# EAGLE design schematic (EAGLE 8.3.1)
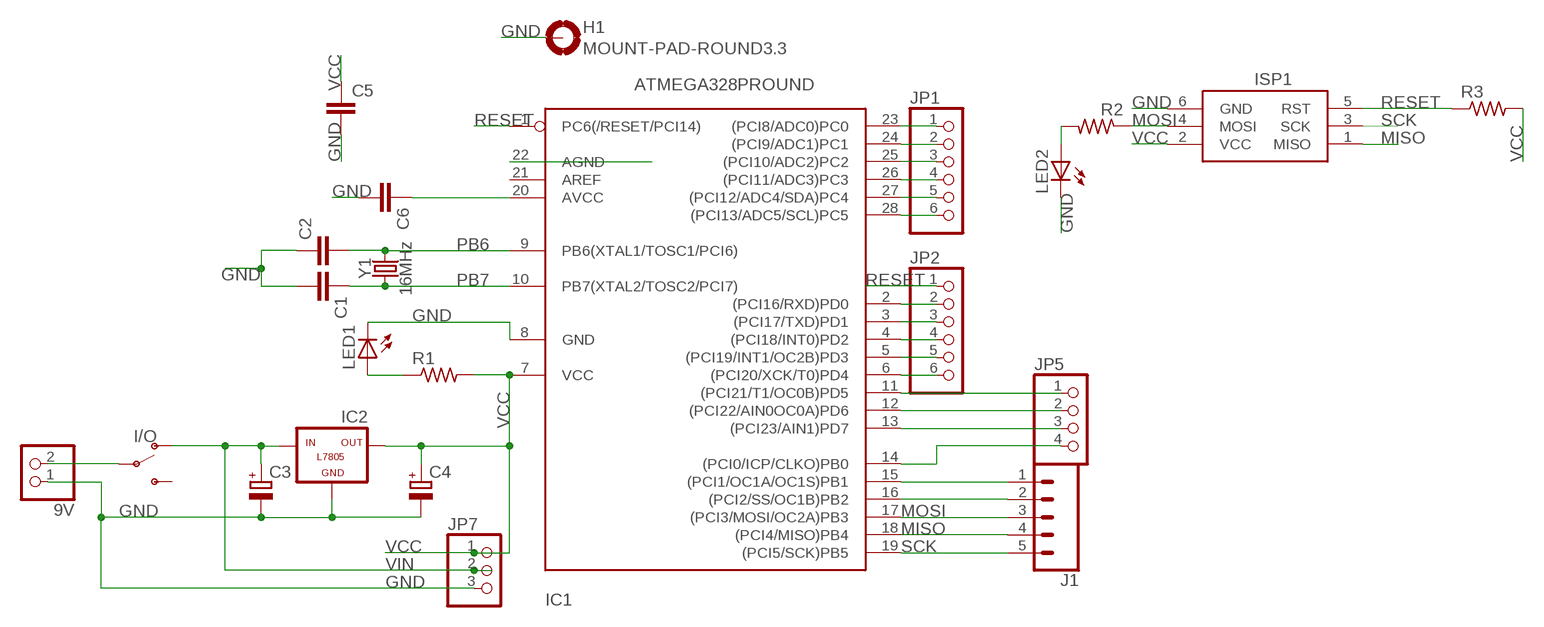
[diagram p0: schematic, sheet 1]

## Parts
9V  PINHD-1X2M  [1X02M]
C1  C5/5  [C5B5]
C2  C5/5  [C5B5]
C3  CPOL-EUB45181A  [B45181A]
C4  CPOL-EUB45181A  [B45181A]
C5  C-EU025-025X050  [C025-025X050]
C6  C-EU025-025X050  [C025-025X050]
H1  MOUNT-PAD-ROUND3.3  [3,3-PAD]
I/O  SWITCH-SPDT-PTH-11.6X4.0MM  [SWITCH_SPDT_PTH_11.6X4.0MM]
IC1  ATMEGA328PROUND  [DIL28-3-ROUND]
IC2  L7805  [78XXL]
ISP1  AVRISP-6  [AVRISP]
J1  CONN_05  [1X05]
JP1  PINHD-1X6  [1X06]
JP2  PINHD-1X6  [1X06]
JP5  PINHD-1X4  [1X04]
JP7  PINHD-1X3  [1X03]
LED1  LED3MM  [LED3MM]
LED2  LED3MM  [LED3MM]
R1  R-US_0207/10  [0207/10]
R2  R-US_0207/10  [0207/10]
R3  R-US_0207/10  [0207/10]
Y1  16MHz  CRYSTAL-16MHZPTH-HC49US  [HC49US]

## Nets
GND: 9V.1 C1.2 C2.1 C3.- C4.- C5.2 C6.2 H1.B3,3(MOUNT) IC1.8(GND) IC1.22(AGND) IC2.GND ISP1.6(GND) JP7.3 LED1.K(C) LED2.K(C)
MISO: IC1.18((PCI4/MISO)PB4) ISP1.1(MISO) J1.4
MOSI: IC1.17((PCI3/MOSI/OC2A)PB3) ISP1.4(MOSI) J1.3 R2.1
N$2: 9V.2 I/O.2(P)
N$3: LED1.A R1.1
N$4: IC1.28((PCI13/ADC5/SCL)PC5) JP1.6
N$5: IC1.27((PCI12/ADC4/SDA)PC4) JP1.5
N$6: IC1.16((PCI2/SS/OC1B)PB2) J1.2
N$7: IC1.15((PCI1/OC1A/OC1S)PB1) J1.1
N$8: IC1.14((PCI0/ICP/CLKO)PB0) JP5.4
N$9: LED2.A R2.2
N$10: IC1.26((PCI11/ADC3)PC3) JP1.4
N$11: IC1.25((PCI10/ADC2)PC2) JP1.3
N$12: IC1.24((PCI9/ADC1)PC1) JP1.2
N$13: IC1.23((PCI8/ADC0)PC0) JP1.1
N$14: IC1.6((PCI20/XCK/T0)PD4) JP2.6
N$15: IC1.5((PCI19/INT1/OC2B)PD3) JP2.5
N$16: IC1.4((PCI18/INT0)PD2) JP2.4
N$17: IC1.3((PCI17/TXD)PD1) JP2.3
N$18: IC1.2((PCI16/RXD)PD0) JP2.2
N$19: IC1.11((PCI21/T1/OC0B)PD5) JP5.1
N$20: IC1.12((PCI22/AIN0OC0A)PD6) JP5.2
N$21: IC1.13((PCI23/AIN1)PD7) JP5.3
N$22: C6.1 IC1.20(AVCC)
PB6: C2.2 IC1.9(PB6(XTAL1/TOSC1/PCI6)) Y1.2
PB7: C1.1 IC1.10(PB7(XTAL2/TOSC2/PCI7)) Y1.1
RESET: IC1.1(PC6(/RESET/PCI14)) ISP1.5(RST) JP2.1 R3.1
SCK: IC1.19((PCI5/SCK)PB5) ISP1.3(SCK) J1.5
VCC: C4.+ C5.1 IC1.7(VCC) IC2.OUT ISP1.2(VCC) JP7.1 R1.2 R3.2
VIN: C3.+ I/O.1(O) IC2.IN JP7.2
Unconnected: I/O.3(S) IC1.21(AREF)

## Library data of the parts
9V = pinhead:PINHD-1X2: PIN HEADER
C1 C2 = capacitor-wima:C: CAPACITOR naming: grid - package width
C3 C4 = rcl:CPOL-EU: POLARIZED CAPACITOR, European symbol
C5 C6 = resistor:C-EU: CAPACITOR, European symbol
H1 = holes:MOUNT-PAD-ROUND: MOUNTING PAD, round
I/O = SparkFun-Switches:SWITCH-SPDT: Single Pole, Double Throw (SPDT) Switch Single-pole, double-throw (SPDT) switch. Variant Overview SMD-AYZ0202 Surface Mount DPDT Switch <https://www.sparkfun.com/products/597> (COM-00597) Used on e.g. LilyPad Arduino USB - ATmega32U4 Board <https://www.sparkfun.com/products/12049> PTH-11.6X4.0MM SPDT Mini Power Switch <https://www.sparkfun.com/products/102> (COM-00102) Used on e.g. SparkFun Simon Says - Through-Hole Soldering Kit <https://www.sparkfun.com/products/10547> (KIT-10547) PTH-11.6X4.0MM-KIT KIT version of SPDT Mini Power Switch - Simplifies soldering by removing tStop of switch pins - only one side can be soldered. PTH-11.6X4.0MM-LOCK LOCK version of SPDT Mini Power Switch - Offset pins hold switch in place for easier soldering. SMD-RIGHT-ANGLE Surface Mount Right Angle Switch <https://www.sparkfun.com/products/10860> (COM-10860) Used on e.g. SparkFun ESP8266 Thing <https://www.sparkfun.com/products/13231>; PROD_ID: SWCH-08261; SF_SKU: COM-00102
IC1 = atmega328:ATMEGA328*P: MICROCONTROLLER 32 kBytes FLASH 2 kBytes SRAM 1 kBytes EEPROM USART 8-channel 10 bit ADC
IC2 = tango:L7805: VOLTAGE REGULATOR
ISP1 = adafruit:AVRISP: AVR ISP HEADER Standard 6 pin header for AVR programming
J1 = SparkFun-Connectors:CONN_05: Multi connection point. Often used as Generic Header-pin footprint for 0.1 inch spaced/style header connections On any of the 0.1 inch spaced packages, you can populate with these: Break Away Headers - Straight <https://www.sparkfun.com/products/116> (PRT-00116) Break Away Male Headers - Right Angle <https://www.sparkfun.com/products/553> (PRT-00553) Female Headers <https://www.sparkfun.com/products/115> (PRT-00115) Break Away Headers - Machine Pin <https://www.sparkfun.com/products/117> (PRT-00117) Break Away Female Headers - Swiss Machine Pin <https://www.sparkfun.com/products/743> (PRT-00743) For SCREWTERMINALS and SPRING TERMINALS visit here: Screw Terimnals on SparkFun.com <https://www.sparkfun.com/search/results?term=Screw+Terminals> (5mm/3.5mm/2.54mm spacing) This device is also useful as a general connection point to wire up your design to another part of your project. Our various solder wires solder well into these plated through hole pads. Hook-Up Wire - Assortment (Stranded, 22 AWG) <https://www.sparkfun.com/products/11375> (PRT-11375) Hook-Up Wire - Assortment (Solid Core, 22 AWG) <https://www.sparkfun.com/products/11367> (PRT-11367) View the entire wire category on our website here <https://www.sparkfun.com/categories/141> Special notes: Molex polarized connector foot print use with SKU : PRT-08231 with associated crimp pins and housings. 1MM SMD Version SKU: PRT-10208
JP1 JP2 = adafruit:PINHD-1X6: PIN HEADER
JP5 = pinhead:PINHD-1X4: PIN HEADER
JP7 = pinhead:PINHD-1X3: PIN HEADER
LED1 LED2 = adafruit:LED: LED OSRAM: - CHIPLED LG R971, LG N971, LY N971, LG Q971, LY Q971, LO R971, LY R971 LH N974, LH R974 LS Q976, LO Q976, LY Q976 LO Q996 - Hyper CHIPLED LW Q18S LB Q993, LB Q99A, LB R99A - SideLED LS A670, LO A670, LY A670, LG A670, LP A670 LB A673, LV A673, LT A673, LW A673 LH A674 LY A675 LS A676, LA A676, LO A676, LY A676, LW A676 LS A679, LY A679, LG A679 - Hyper Micro SIDELED® LS Y876, LA Y876, LO Y876, LY Y876 LT Y87S - SmartLED LW L88C, LW L88S LB L89C, LB L89S, LG L890 LS L89K, LO L89K, LY L89K LS L896, LA L896, LO L896, LY L896 - TOPLED LS T670, LO T670, LY T670, LG T670, LP T670 LSG T670, LSP T670, LSY T670, LOP T670, LYG T670 LG T671, LOG T671, LSG T671 LB T673, LV T673, LT T673, LW T673 LH T674 LS T676, LA T676, LO T676, LY T676, LB T676, LH T676, LSB T676, LW T676 LB T67C, LV T67C, LT T67C, LS T67K, LO T67K, LY T67K, LW E67C LS E67B, LA E67B, LO E67B, LY E67B, LB E67C, LV E67C, LT E67C LW T67C LS T679, LY T679, LG T679 LS T770, LO T770, LY T770, LG T770, LP T770 LB T773, LV T773, LT T773, LW T773 LH T774 LS E675, LA E675, LY E675, LS T675 LS T776, LA T776, LO T776, LY T776, LB T776 LHGB T686 LT T68C, LB T68C - Hyper Mini TOPLED® LB M676 - Mini TOPLED Santana® LG M470 LS M47K, LO M47K, LY M47K Source: http://www.osram.convergy.de/
R1-R3 = resistor:R-US_: RESISTOR, American symbol
Y1 = SparkFun-Clocks:CRYSTAL-16MHZ: 16MHz Crystal Digikey Example <http://www.digikey.com/product-search/en?keywords=535-9122-1-ND> Frequency: 16MHz Frequency Stability: ±50ppm Frequency Tolerance: ±20ppm Load Capacitance: 18pF SparkFun Products: Pro Micro -5V/16MHz <https://www.sparkfun.com/products/12640> SparkFun Serial Enabled LCD Kit <https://www.sparkfun.com/products/10097>; PROD_ID: XTAL-08181; SF_ID: COM-00536

## Board
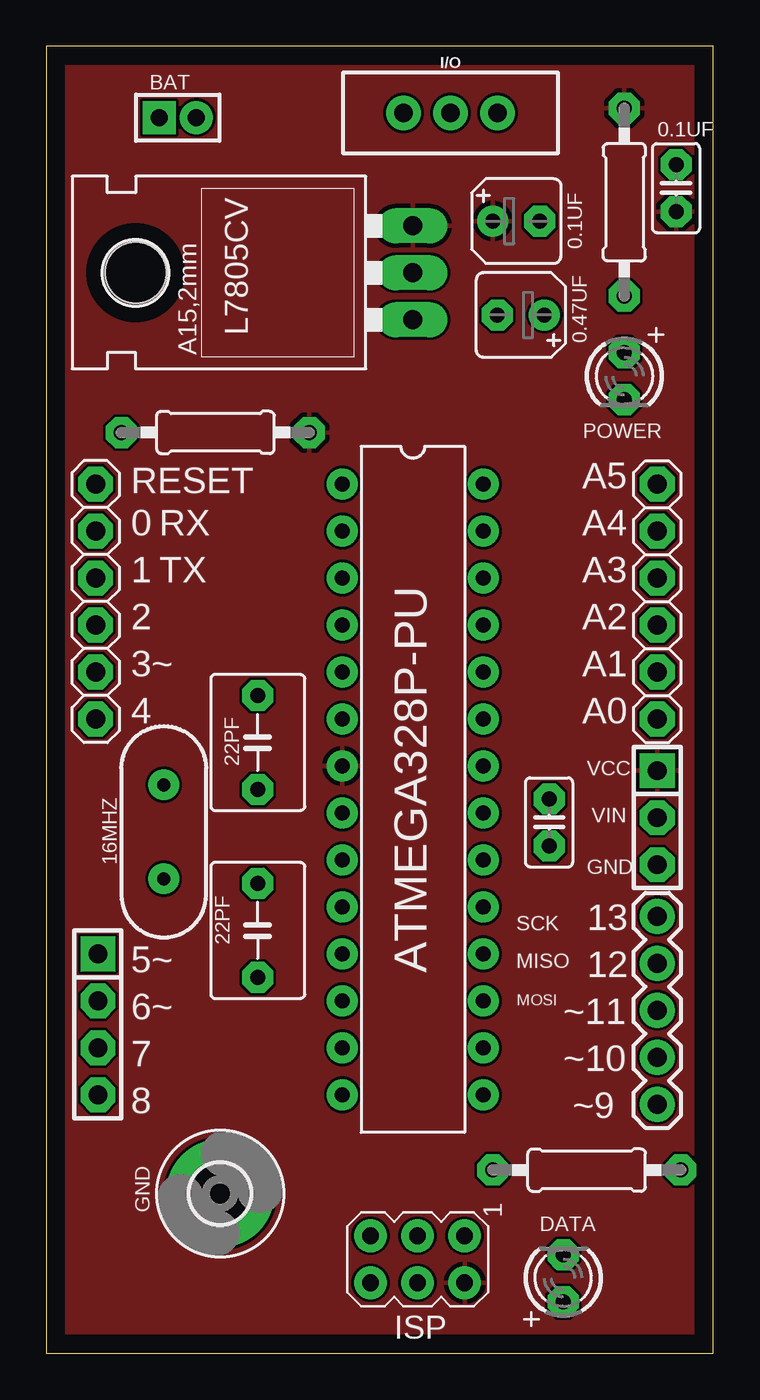
[diagram p1: board, top side]
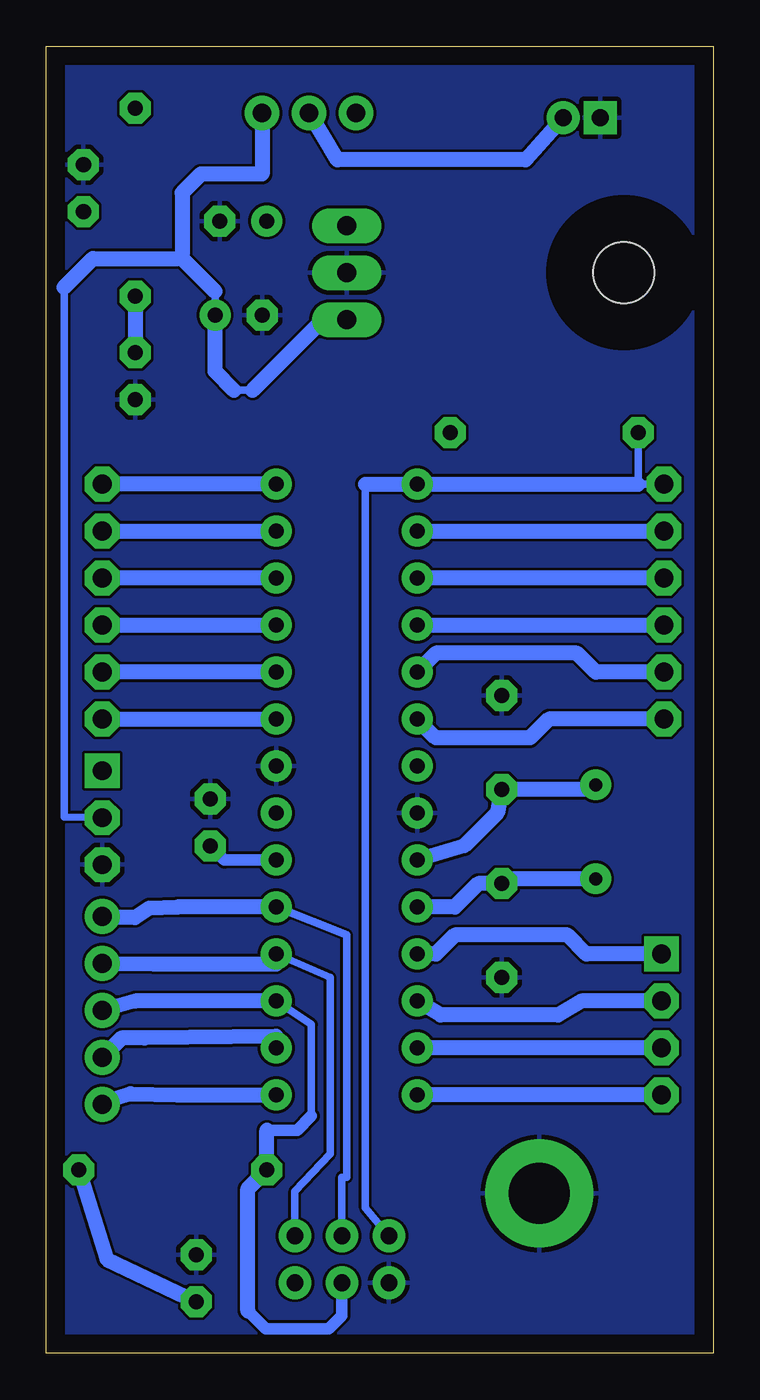
[diagram p2: board, bottom side, seen from below]

Size 36.05 x 70.66 mm. Coordinates in mm from the lower left corner, seen from the top.
Outline: 0,0 36.05,0 36.05,70.66 0,70.66 0,0
Copper layers (1*16): Top 0.035mm / dielectric 1.5mm / Bottom 0.035mm
Design rules "default *": minimum track width 6mil, minimum drill 0.35mm, track to track 6mil, track to pad 6mil, pad to pad 6mil, via to via 6mil, smd to smd 6mil, copper to edge 40mil, drill to drill 6mil, minimum pad ring 17mil, minimum via ring 15mil, stop-mask expansion 4mil, vias tented up to drill 0mil, thermal gap 10mil

### Footprints (pad centres in the part's own frame; a part is rotated, then mirrored left to right if it is on the bottom)
1X02M = drill 0.914 square: 1 -1,0 | drill 0.914: 2 1,0
C5B5 = drill 0.813 pad 1.6 octagon: 1 -2.54,0; 2 2.54,0
B45181A = drill 0.813 pad 1.6: + -1.27,0 | drill 0.813 pad 1.6 octagon: - 1.27,0
C025-025X050 = drill 0.813 octagon: 1 -1.27,0; 2 1.27,0
3,3-PAD = drill 3.3 pad 5.842: B3,3 0,0
SWITCH_SPDT_PTH_11.6X4.0MM = drill 1.016 pad 1.88: 1 0,2.54; 2 0,0; 3 0,-2.54
DIL28-3-ROUND = drill 0.813 pad 1.676: 1 -16.51,-3.81; 2 -13.97,-3.81; 3 -11.43,-3.81; 4 -8.89,-3.81; 5 -6.35,-3.81; 6 -3.81,-3.81; 7 -1.27,-3.81; 8 1.27,-3.81; 9 3.81,-3.81; 10 6.35,-3.81; 11 8.89,-3.81; 12 11.43,-3.81; 13 13.97,-3.81; 14 16.51,-3.81; 15 16.51,3.81; 16 13.97,3.81; 17 11.43,3.81; 18 8.89,3.81; 19 6.35,3.81; 20 3.81,3.81; 21 1.27,3.81; 22 -1.27,3.81; 23 -3.81,3.81; 24 -6.35,3.81; 25 -8.89,3.81; 26 -11.43,3.81; 27 -13.97,3.81; 28 -16.51,3.81
78XXL = drill 1.016 long: GND 0,-3.81; IN -2.54,-3.81; OUT 2.54,-3.81 | hole 3.302: 0,11.176
AVRISP = drill 0.9 pad 1.626: 1 -1.27,2.54; 2 1.27,2.54; 3 -1.27,0; 4 1.27,0; 5 -1.27,-2.54; 6 1.27,-2.54
1X05 = drill 1.016 pad 1.88: 1 0,0; 2 2.54,0; 3 5.08,0; 4 7.62,0; 5 10.16,0
1X06 = drill 1.016 octagon: 1 -6.35,0; 2 -3.81,0; 3 -1.27,0; 4 1.27,0; 5 3.81,0; 6 6.35,0
1X04 = drill 1.016 square: 1 -3.81,0 | drill 1.016 octagon: 2 -1.27,0; 3 1.27,0; 4 3.81,0
1X03 = drill 1.016 square: 1 -2.54,0 | drill 1.016 octagon: 2 0,0; 3 2.54,0
LED3MM = drill 0.813 pad 1.676 octagon: A -1.27,0; K 1.27,0
0207/10 = drill 0.813 octagon: 1 -5.08,0; 2 5.08,0
HC49US = drill 0.7 pad 1.651: 1 -2.54,0; 2 2.54,0

### Placement (x,y rotation side)
9V  7.11,66.8 0 top
C1  11.43,22.86 270 top
C2  11.43,33.02 270 top
C3  25.65,56.13 180 top
C4  25.4,61.21 0 top
C5  34.04,62.99 90 top
C6  27.18,28.7 90 top
H1  9.4,8.64 0 top
I/O  21.84,67.06 270 top
IC1  19.81,30.48 270 top
IC2  16,58.42 90 top
ISP1  20.07,5.08 270 top
J1  33.02,13.46 90 top
JP1  33.02,40.64 90 top
JP2  2.67,40.64 270 top
JP5  2.79,17.78 270 top
JP7  33.02,28.96 270 top
LED1  31.24,52.83 270 top
LED2  27.94,4.06 90 top
R1  31.24,62.23 90 top
R2  29.21,9.91 0 top
R3  9.14,49.78 0 top
Y1  6.35,28.19 90 top

### Tracks (layer width: path | path; a pad name or v marks a point on that pad's centre or on a via)
GND
  pour Bottom: -2.54,-2.67 36.83,-4.06 39.62,84.84 -5.59,86.23
MISO
  Bottom 0.406: 23.62,21.05 IC1.18 20.7,20.32 20.7,10.79 22.61,8.76 ISP1.1
  Bottom 0.813: 23.62,21.05 30.23,21.05 J1.4
MOSI
  Bottom 0.406: 21.72,12.83 21.72,17.78 IC1.17
  Bottom 0.61: ISP1.4 20.07,2.03 20.78,1.32 24.18,1.32 25.15,2.29 | 24.12,12.07 22.48,12.07 21.72,12.83
  Bottom 0.813: IC1.17 31.24,19.05 J1.3 | 24.12,12.07 24.13,12.05 R2.1 25.15,8.89 25.15,2.29
N$2
  Bottom 0.813: 9V.2 10.14,64.52 20.32,64.52 I/O.2
N$3
  Bottom 0.813: R1.1 LED1.A
N$4
  Bottom 0.813: IC1.28 JP1.6
N$5
  Bottom 0.813: JP1.5 IC1.27
N$6
  Bottom 0.406: IC1.16 23.62,17.14
  Bottom 0.813: 23.62,17.14 30.73,17.05 31.97,17.05 J1.2
N$7
  Bottom 0.152: 33.02,13.53 32.77,13.46 J1.1
  Bottom 0.813: 33.02,13.53 31.5,14.03 28.96,13.97 IC1.15
N$8
  Bottom 0.813: JP5.4 IC1.14
N$9
  Bottom 0.813: R2.2 32.77,5.08 LED2.A
N$10
  Bottom 0.813: IC1.26 JP1.4
N$11
  Bottom 0.813: JP1.3 IC1.25
N$12
  Bottom 0.813: IC1.24 JP1.2
N$13
  Bottom 0.813: JP1.1 IC1.23
N$14
  Bottom 0.813: JP2.6 8.89,34.29 9.91,33.27 14.99,33.27 IC1.6
N$15
  Bottom 0.813: JP2.5 6.35,36.83 7.37,37.85 14.99,37.85 IC1.5
N$16
  Bottom 0.813: IC1.4 JP2.4
N$17
  Bottom 0.406: 16,41.28 IC1.3
  Bottom 0.813: JP2.3 IC1.3
N$18
  Bottom 0.813: IC1.2 JP2.2
N$19
  Bottom 0.813: IC1.11 14.99,21.59 13.97,22.61 7.87,22.61 6.86,21.59 JP5.1
N$20
  Bottom 0.813: JP5.2 7.11,19.05 8.38,18.29 14.73,18.29 IC1.12
N$21
  Bottom 0.813: JP5.3 IC1.13
N$22
  Bottom 0.61: IC1.20 26.42,26.67 C6.1
PB6
  Bottom 0.406: 6.6,30.48 Y1.2
  Bottom 0.813: 6.6,30.48 C2.2 11.68,29.21 13.46,27.43 IC1.9
PB7
  Bottom 0.406: 11.18,25.65 C1.1
  Bottom 0.813: Y1.1 11.18,25.65 | C1.1 12.7,25.4 13.97,24.13 IC1.10
RESET
  Bottom 0.406: JP2.1 4.06,46.99 R3.1 | ISP1.5 18.8,7.87 18.8,46.99
  Bottom 0.813: 4.06,46.99 IC1.1 18.8,46.99
SCK
  Bottom 0.152: 32.96,23.56 J1.5
  Bottom 0.406: ISP1.3 20.07,9.52 19.81,9.52 19.81,22.61 IC1.19
  Bottom 0.813: IC1.19 28.96,24.13 30.48,24.07 31.24,23.56 32.96,23.56
VCC
  pour Top: -1.65,-2.03 38.1,-1.78 38.1,83.82 -2.92,83.06
VIN
  Bottom 0.406: JP7.2 35.08,28.99 35.08,57.63 | 28.7,59.18 28.9,59.18 28.7,59.38 | IC2.IN 21.08,55.88 | 24.89,52.07 25.91,52.07 | C3.+ 26.92,57.4
  Bottom 0.813: I/O.1 24.38,63.75 27.69,63.75 28.7,62.74 28.7,59.38 | 21.08,55.88 24.89,52.07 | 25.91,52.07 26.92,53.09 C3.+ | 26.92,57.4 28.7,59.18 | 35.08,57.63 33.53,59.18 28.9,59.18

### Text on the board
tNames: BAT | 0.1UF | L7805CV | 0.1UF | 0.47UF | POWER | RESET | A5 | 0 | RX | A4 | 1 | TX | A3 | 2 | A2 | 3~ | A1 | 4 | A0 | 22PF | VCC | VIN | 16MHZ | GND | 22PF | SCK | 13 | 5~ | ATMEGA328P-PU | MISO | 12 | 6~ | MOSI | ~11 | 7 | ~10 | 8 | ~9 | GND | DATA | ISP
tStop: Atmega328P-PU / Breakout programmer
bStop: Nick Hulsey 5/9/2018